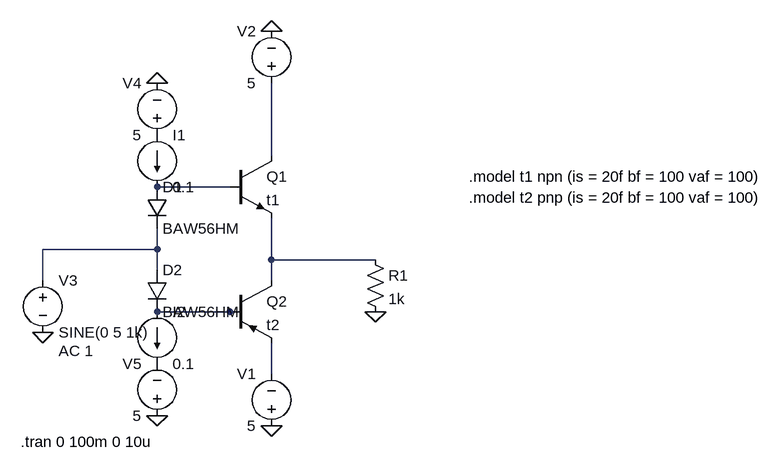
[diagram p0: schematic part_a.asc]
part_a.asc, the LTspice schematic file:
Version 4
SHEET 1 1148 680
WIRE 304 48 304 -64
WIRE 240 96 128 96
WIRE 128 192 128 160
WIRE 128 192 -48 192
WIRE 304 208 304 144
WIRE 464 208 304 208
WIRE 128 224 128 192
WIRE -48 240 -48 192
WIRE 304 240 304 208
WIRE 240 288 128 288
WIRE 256 288 240 288
WIRE 304 384 304 336
FLAG 304 464 0
FLAG 304 -144 0
FLAG 464 288 0
FLAG -48 320 0
FLAG 128 -64 0
FLAG 128 448 0
SYMBOL diode 112 96 R0
SYMATTR InstName D1
SYMATTR Value BAW56HM
SYMBOL diode 112 224 R0
SYMATTR InstName D2
SYMATTR Value BAW56HM
SYMBOL npn 240 48 R0
SYMATTR InstName Q1
SYMATTR Value t1
SYMBOL pnp 240 240 R0
SYMATTR InstName Q2
SYMATTR Value t2
SYMBOL voltage 304 480 R180
WINDOW 0 24 96 Left 2
WINDOW 3 24 16 Left 2
SYMATTR InstName V1
SYMATTR Value 5
SYMBOL voltage 304 -48 R180
WINDOW 0 24 96 Left 2
WINDOW 3 24 16 Left 2
SYMATTR InstName V2
SYMATTR Value 5
SYMBOL res 448 192 R0
SYMATTR InstName R1
SYMATTR Value 1k
SYMBOL voltage -48 224 R0
WINDOW 123 24 124 Left 2
WINDOW 39 0 0 Left 0
SYMATTR InstName V3
SYMATTR Value SINE(0 5 1k)
SYMATTR Value2 AC 1
SYMBOL current 128 16 R0
WINDOW 123 0 0 Left 0
WINDOW 39 0 0 Left 0
SYMATTR InstName I1
SYMATTR Value 0.1
SYMBOL current 128 288 R0
WINDOW 123 0 0 Left 0
WINDOW 39 0 0 Left 0
SYMATTR InstName I2
SYMATTR Value 0.1
SYMBOL voltage 128 32 R180
WINDOW 0 24 96 Left 2
WINDOW 3 24 16 Left 2
SYMATTR InstName V4
SYMATTR Value 5
SYMBOL voltage 128 464 R180
WINDOW 0 24 96 Left 2
WINDOW 3 24 16 Left 2
SYMATTR InstName V5
SYMATTR Value 5
TEXT 608 80 Left 2 !.model t1 npn (is = 20f bf = 100 vaf = 100)
TEXT 608 112 Left 2 !.model t2 pnp (is = 20f bf = 100 vaf = 100)
TEXT -82 488 Left 2 !.tran 0 100m 0 10u

The netlist it stands for:
* part_a.asc
D1 N002 N003 BAW56HM
D2 N003 N005 BAW56HM
Q1 N001 N002 N004 0 t1
Q2 N004 N005 N006 0 t2
V1 0 N006 5
V2 N001 0 5
R1 N004 0 1k
V3 N003 0 SINE(0 5 1k) AC 1
I1 P001 N002 0.1
I2 N005 P002 0.1
V4 P001 0 5
V5 0 P002 5
.model D D
.lib standard.dio
.model NPN NPN
.model PNP PNP
.lib standard.bjt
.model t1 npn (is = 20f bf = 100 vaf = 100)
.model t2 pnp (is = 20f bf = 100 vaf = 100)
.tran 0 100m 0 10u
.backanno
.end